# Altium project F1_ESC_V1.0.PrjPcb
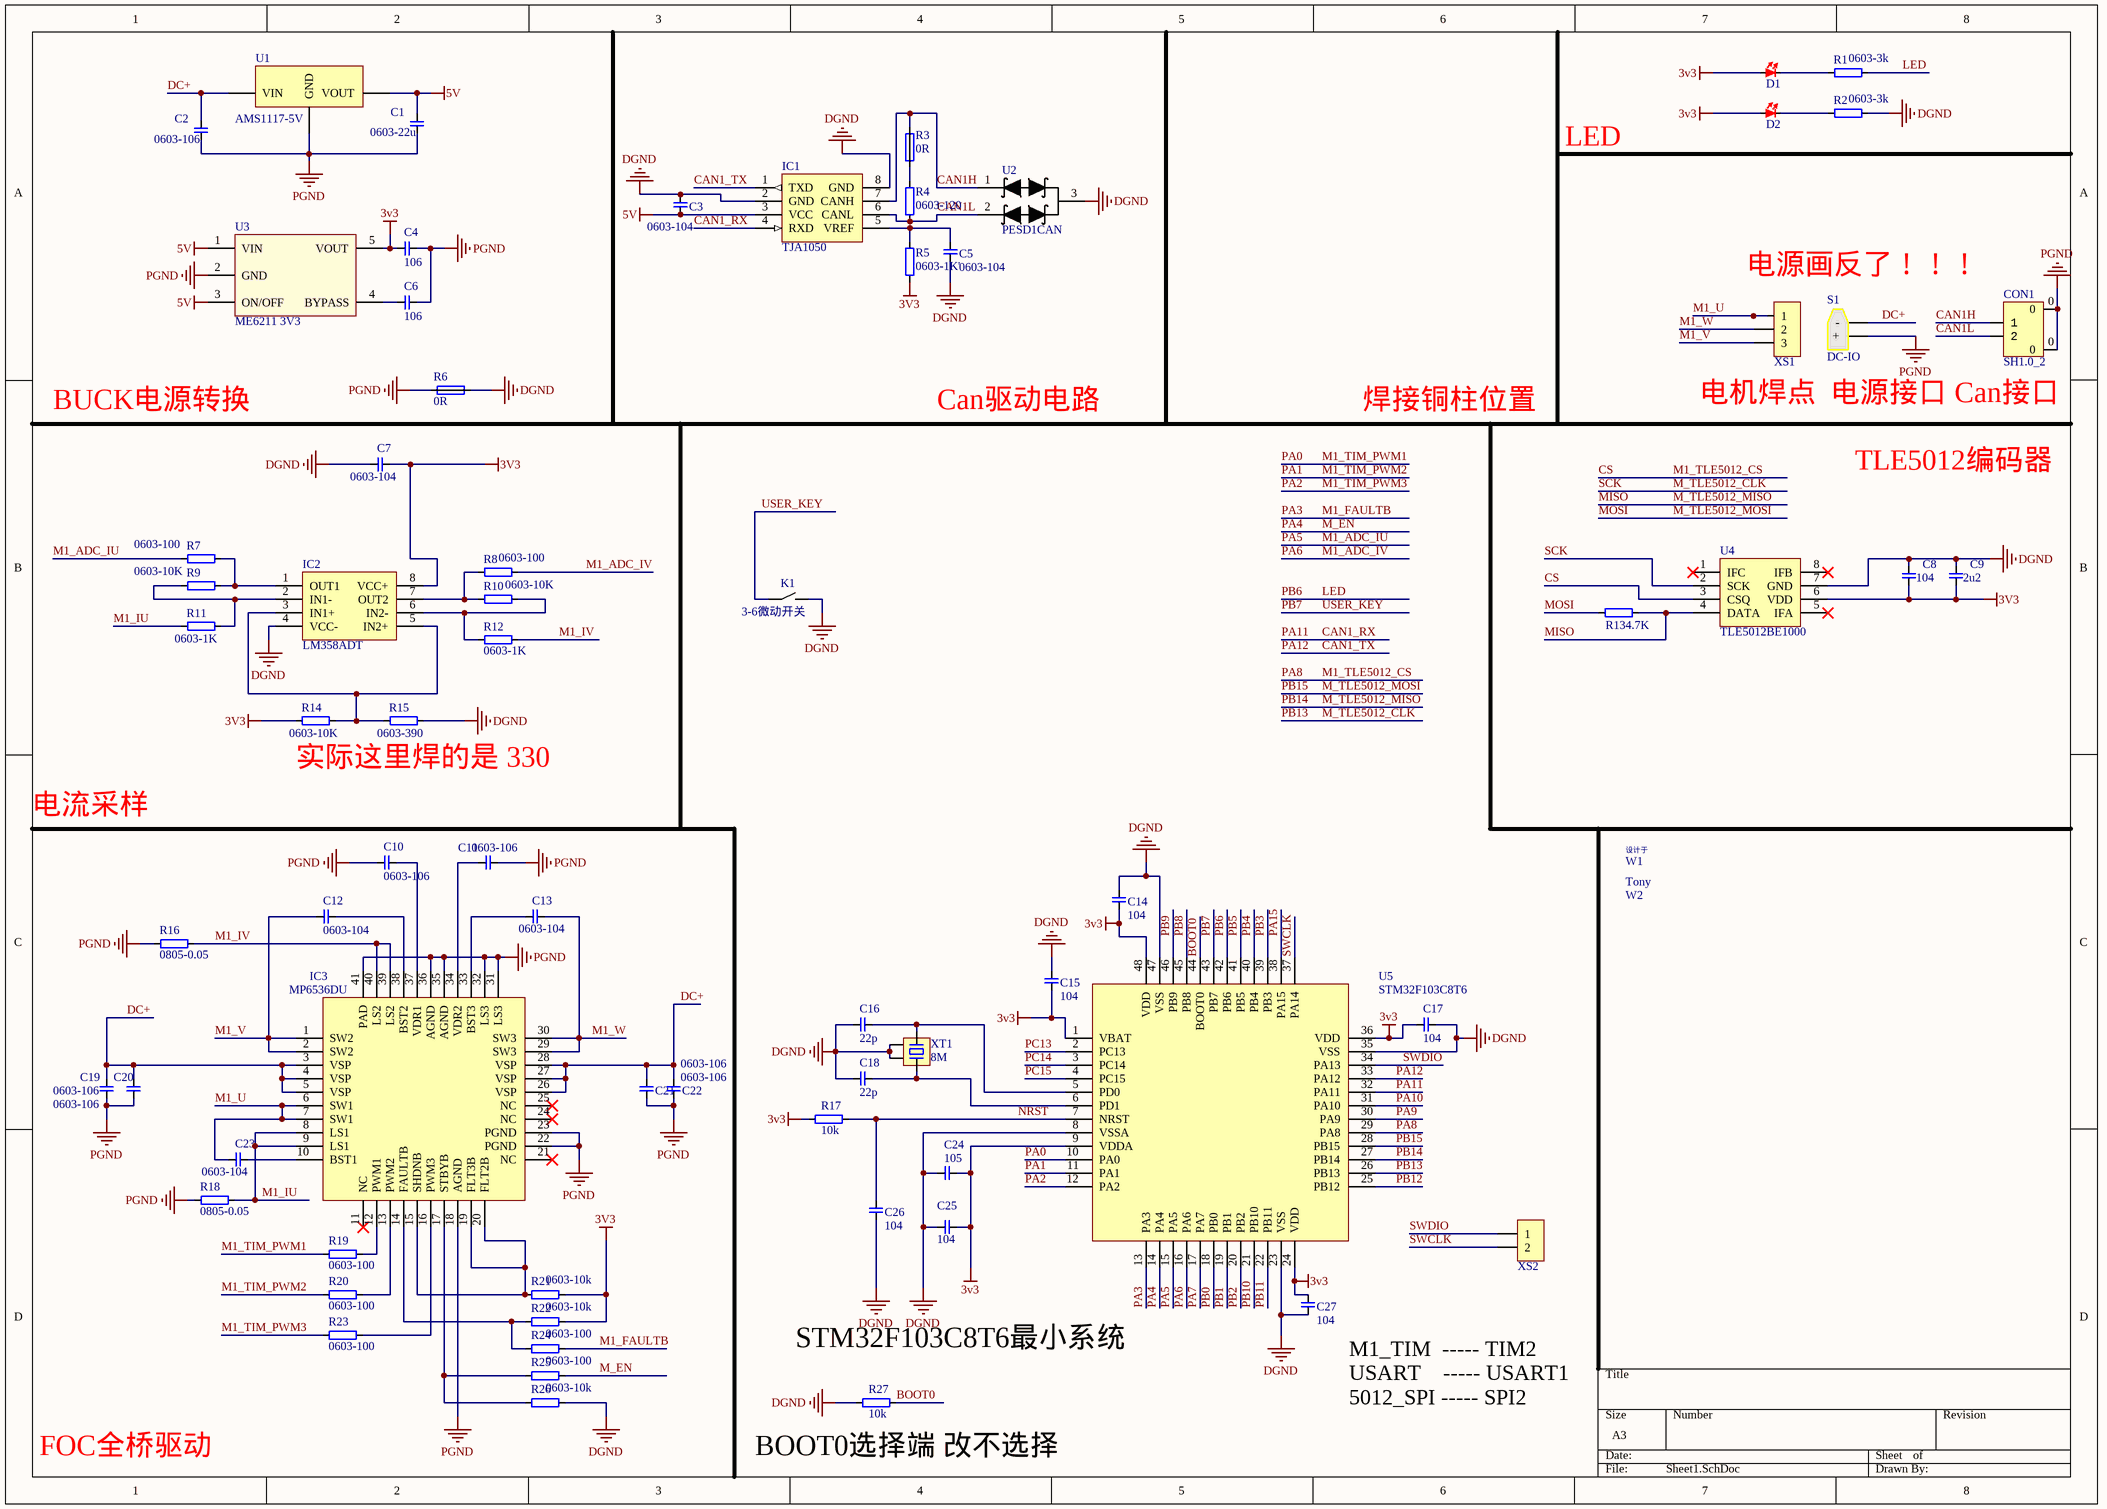
[diagram p0: Sheet1.SchDoc]
1 sheet, 72 parts. Net scope: global (net labels, ports and power ports of the same name join across sheets).
Board file: PCB1.PcbDoc

## Sheet Sheet1.SchDoc
size A3; SheetNumber: 1; SheetTotal: 1

### Parts
C1  0603-22u  [CAP_0603]
C2  0603-106  [CAP_0603]
C3  0603-104  [CAP_0603]
C4  106  [CAP_0603]
C5  0603-104  [CAP_0603]
C6  106  [CAP_0603]
C7  0603-104  [CAP_0603]
C8  104  [CAP_0603]
C9  2u2  [CAP_0603]
C10  0603-106  [CAP_0603]
C11  0603-106  [CAP_0603]
C12  0603-104  [CAP_0603]
C13  0603-104  [CAP_0603]
C14  104  [CAP_0603]
C15  104  [CAP_0603]
C16  22p  [CAP_0603]
C17  104  [CAP_0603]
C18  22p  [CAP_0603]
C19  0603-106  [CAP_0603]
C20  0603-106  [CAP_0603]
C21  0603-106  [CAP_0603]
C22  0603-106  [CAP_0603]
C23  0603-104  [CAP_0603]
C24  105  [CAP_0603]
C25  104  [CAP_0603]
C26  104  [CAP_0603]
C27  104  [CAP_0603]
CON1  SH1.0_2  [SH1.0 Horizontal 2P]
D1  led  [led0603]  (value not drawn)
D2  led  [led0603]  (value not drawn)
IC1  TJA1050  [SOP8_N]
IC2  LM358ADT  [SOP8_N]
IC3  MP6536DU  [QFN-40_5X5]
K1  3-6微动开关  [3-6微动开关]
R1  0603-3k  [RES_0603]
R2  0603-3k  [RES_0603]
R3  0R  [RES_0603-SHORT]
R4  0603-120  [RES_0603]
R5  0603-1K'  [RES_0603]
R6  0R  [RES_0603-SHORT]
R7  0603-100  [RES_0603]
R8  0603-100  [RES_0603]
R9  0603-10K  [RES_0603]
R10  0603-10K  [RES_0603]
R11  0603-1K  [RES_0603]
R12  0603-1K  [RES_0603]
R13  4.7K  [RES_0603]
R14  0603-10K  [RES_0603]
R15  0603-390  [RES_0603]
R16  0805-0.05  [RES_0805]
R17  10k  [RES_0603]
R18  0805-0.05  [RES_0805]
R19  0603-100  [RES_0603]
R20  0603-100  [RES_0603]
R21  0603-10k  [RES_0603]
R22  0603-10k  [RES_0603]
R23  0603-100  [RES_0603]
R24  0603-100  [RES_0603]
R25  0603-100  [RES_0603]
R26  0603-10k  [RES_0603]
R27  10k  [RES_0603]
S1  DC-IO  [XT30UPB-M]
U1  AMS1117-5V  [SOT223]
U2  PESD1CAN  [SOT23-3]
U3  ME6211 3V3  [SOT23-5]
U4  TLE5012BE1000  [SO-8]
U5  STM32F103C8T6  [LQFP48]
W1  设计于  [designed by（430-70）]  (value not drawn)
W2  Tony  [Tony_2(200-70)]  (value not drawn)
XS1  HDR-1X3  [SSP-3P]  (value not drawn)
XS2  HDR-1X2  [SSP-2P]  (value not drawn)
XT1  8M  [SMD3225_4p]

### Nets
3V3: C4.2 C7.2 C8.1 C9.1 C14.2 C15.1 C17.2 C24.2 C25.2 C27.2 D1.1 D2.1 IC2.8(VCC+) R5.1 R14.2 R17.1 R21.2 R22.2 U3.5(VOUT) U4.6(VDD) U5.1(VBAT) U5.9(VDDA) U5.24(VDD) U5.36(VDD) U5.48(VDD)
5V: C1.2 C3.1 IC1.3(VCC) U1.2(VOUT) U3.1(VIN) U3.3(ON/OFF)
DGND: C3.2 C5.1 C7.1 C8.2 C9.2 C14.1 C15.2 C16.2 C17.1 C18.2 C24.1 C25.1 C26.2 C27.1 IC1.2(GND) IC1.8(GND) IC2.4(VCC-) K1.2 R2.2 R6.1 R15.1 R26.2 R27.1 U2.3 U4.7(GND) U5.8(VSSA) U5.23(VSS) U5.35(VSS) U5.47(VSS) XT1.2(GND) XT1.4(GND)
PGND: C1.1 C2.1 C4.1 C6.1 C10.1 C11.1 C19.1 C20.1 C21.1 C22.1 CON1.0 IC3.18(AGND) IC3.22(PGND) IC3.23(PGND) IC3.31(LS3) IC3.32(LS3) IC3.35(AGND) IC3.36(AGND) IC3.41(PAD) R6.2 R16.1 R18.1 S1.1(+) U1.1(GND) U3.2(GND)
BOOT0: R27.2 U5.44(BOOT0)
CAN1_RX: IC1.4(RXD) U5.32(PA11)  [also labelled PA11]
CAN1_TX: IC1.1(TXD) U5.33(PA12)  [also labelled PA12]
CAN1H: CON1.1 IC1.7(CANH) R3.1 U2.1
CAN1L: CON1.2 IC1.6(CANL) R4.1 U2.2
CS: U4.3(CSQ) U5.29(PA8)  [also labelled M1_TLE5012_CS, PA8]
DC+: C2.2 C19.2 C20.2 C21.2 C22.2 IC3.3(VSP) IC3.4(VSP) IC3.5(VSP) IC3.26(VSP) IC3.27(VSP) IC3.28(VSP) S1.2(-) U1.3(VIN)
LED: R1.2 U5.42(PB6)  [also labelled PB6]
M1_ADC_IU: R7.2 U5.15(PA5)  [also labelled PA5]
M1_ADC_IV: R8.2 U5.16(PA6)  [also labelled PA6]
M1_FAULTB: R24.2 U5.13(PA3)  [also labelled PA3]
M1_IU: IC3.8(LS1) IC3.9(LS1) R11.2 R18.2
M1_IV: IC3.39(LS2) IC3.40(LS2) R12.2 R16.2
M1_TIM_PWM1: R19.1 U5.10(PA0)  [also labelled PA0]
M1_TIM_PWM2: R20.1 U5.11(PA1)  [also labelled PA1]
M1_TIM_PWM3: R23.1 U5.12(PA2)  [also labelled PA2]
M1_U: C23.2 IC3.6(SW1) IC3.7(SW1) XS1.1
M1_V: C12.1 IC3.1(SW2) IC3.2(SW2) XS1.3
M1_W: C13.1 IC3.29(SW3) IC3.30(SW3) XS1.2
M_EN: R25.2 U5.14(PA4)  [also labelled PA4]
M_TLE5012_CLK: U4.2(SCK) U5.26(PB13)  [also labelled PB13, SCK]
M_TLE5012_MISO: R13.2 U4.4(DATA) U5.27(PB14)  [also labelled MISO, PB14]
M_TLE5012_MOSI: R13.1 U5.28(PB15)  [also labelled MOSI, PB15]
NRST: C26.1 R17.2 U5.7(NRST)
PA7: U5.17(PA7)
PA9: U5.30(PA9)
PA10: U5.31(PA10)
PA15: U5.38(PA15)
PB0: U5.18(PB0)
PB1: U5.19(PB1)
PB2: U5.20(PB2)
PB3: U5.39(PB3)
PB4: U5.40(PB4)
PB5: U5.41(PB5)
PB7: K1.1 U5.43(PB7)  [also labelled USER_KEY]
PB8: U5.45(PB8)
PB9: U5.46(PB9)
PB10: U5.21(PB10)
PB11: U5.22(PB11)
PB12: U5.25(PB12)
PC13: U5.2(PC13)
PC14: U5.3(PC14)
PC15: U5.4(PC15)
SWCLK: U5.37(PA14) XS2.2
SWDIO: U5.34(PA13) XS2.1
NetC5_2: C5.2 IC1.5(VREF) R5.2
NetC6_2: C6.2 U3.4(BYPASS)
NetC10_2: C10.2 IC3.37(VDR1)
NetC11_2: C11.2 IC3.34(VDR2)
NetC12_2: C12.2 IC3.38(BST2)
NetC13_2: C13.2 IC3.33(BST3)
NetC16_1: C16.1 U5.5(PD0) XT1.1
NetC18_1: C18.1 U5.6(PD1) XT1.3
NetC23_1: C23.1 IC3.10(BST1)
NetD1_2: D1.2 R1.1
NetD2_2: D2.2 R2.1
NetIC2_1: IC2.1(OUT1) R7.1 R9.1
NetIC2_2: IC2.2(IN1-) R9.2 R11.1
NetIC2_3: IC2.3(IN1+) IC2.5(IN2+) R14.1 R15.2
NetIC2_6: IC2.6(IN2-) R10.2 R12.1
NetIC2_7: IC2.7(OUT2) R8.1 R10.1
NetIC3_12: IC3.12(PWM1) R19.2
NetIC3_13: IC3.13(PWM2) R20.2
NetIC3_14: IC3.14(FAULTB) R22.1 R24.1
NetIC3_15: IC3.15(SHDNB) IC3.19(FLT3B) IC3.20(FLT2B) R21.1
NetIC3_16: IC3.16(PWM3) R23.2
NetIC3_17: IC3.17(STBYB) R25.1 R26.1
NetR3_2: R3.2 R4.2

Not connected (* = marked no-connect by the designer): IC3 11(NC)* 21(NC)* 24(NC)* 25(NC)*; U4 1(IFC)* 5(IFA)* 8(IFB)*

### Notes on the sheet
- LED
- 电源画反了！！！
- BUCK电源转换
- Can驱动电路
- 焊接铜柱位置
- 电机焊点  电源接口 Can接口
- TLE5012编码器
- 实际这里焊的是 330
- 电流采样
- (near R27) STM32F103C8T6最小系统
- FOC全桥驱动
- (near R27) BOOT0选择端 改不选择
- (near C27) M1_TIM  ----- TIM2
  USART    ----- USART1
  5012_SPI ----- SPI2

### Library data of the parts
C1-C27 = cap
CON1 = SH1.0_2: SH1.0 座子
IC1 = TJA1050: CAN总线收发芯片; 版权归属: 源创客; BOM名称: CAN总线收发芯片; 学习资源: www.ooocke.com
IC2 = LM358ADT: 双通道运放-电流采样芯片; BOM名称: 双通道运放-电流采样芯片
IC3 = MP6536DU: 三通道板桥驱动芯片
K1 = 3-6微动开关: 3*6mm
R1 R2 R4 R5 R7-R27 = Res
R3 R6 = Res-SHORT
S1 = XT30: XT30UPB-I/O
U1 = AMS1117
U2 = PESD1CAN: CAN过压保护,放于外部接口端
U3 = ME6211: LDO
U4 = TLE5012: 磁角度编码器
U5 = STM32F103C8T6-LCC
XS1 = Header 3: 3P接插件; 版权归属: 源创客; BOM名称: 3P接插件; 学习资源: www.ooocke.com
XS2 = Header 2: 2P接插件; 版权归属: 源创客; BOM名称: 2P接插件; 学习资源: www.ooocke.com
XT1 = XTAL-4P